# Altium schematic sheet ETH_PCIE_CTRL.SchDoc: =project_title
size Tabloid; CompanyName: Luxonis Holding; Organization: Luxonis Holding; Address1: 1925 Harmony Park Drive; Address2: Westminster, CO; Address3: 80234; Address4: United States; SheetNumber: 8; SheetTotal: 13
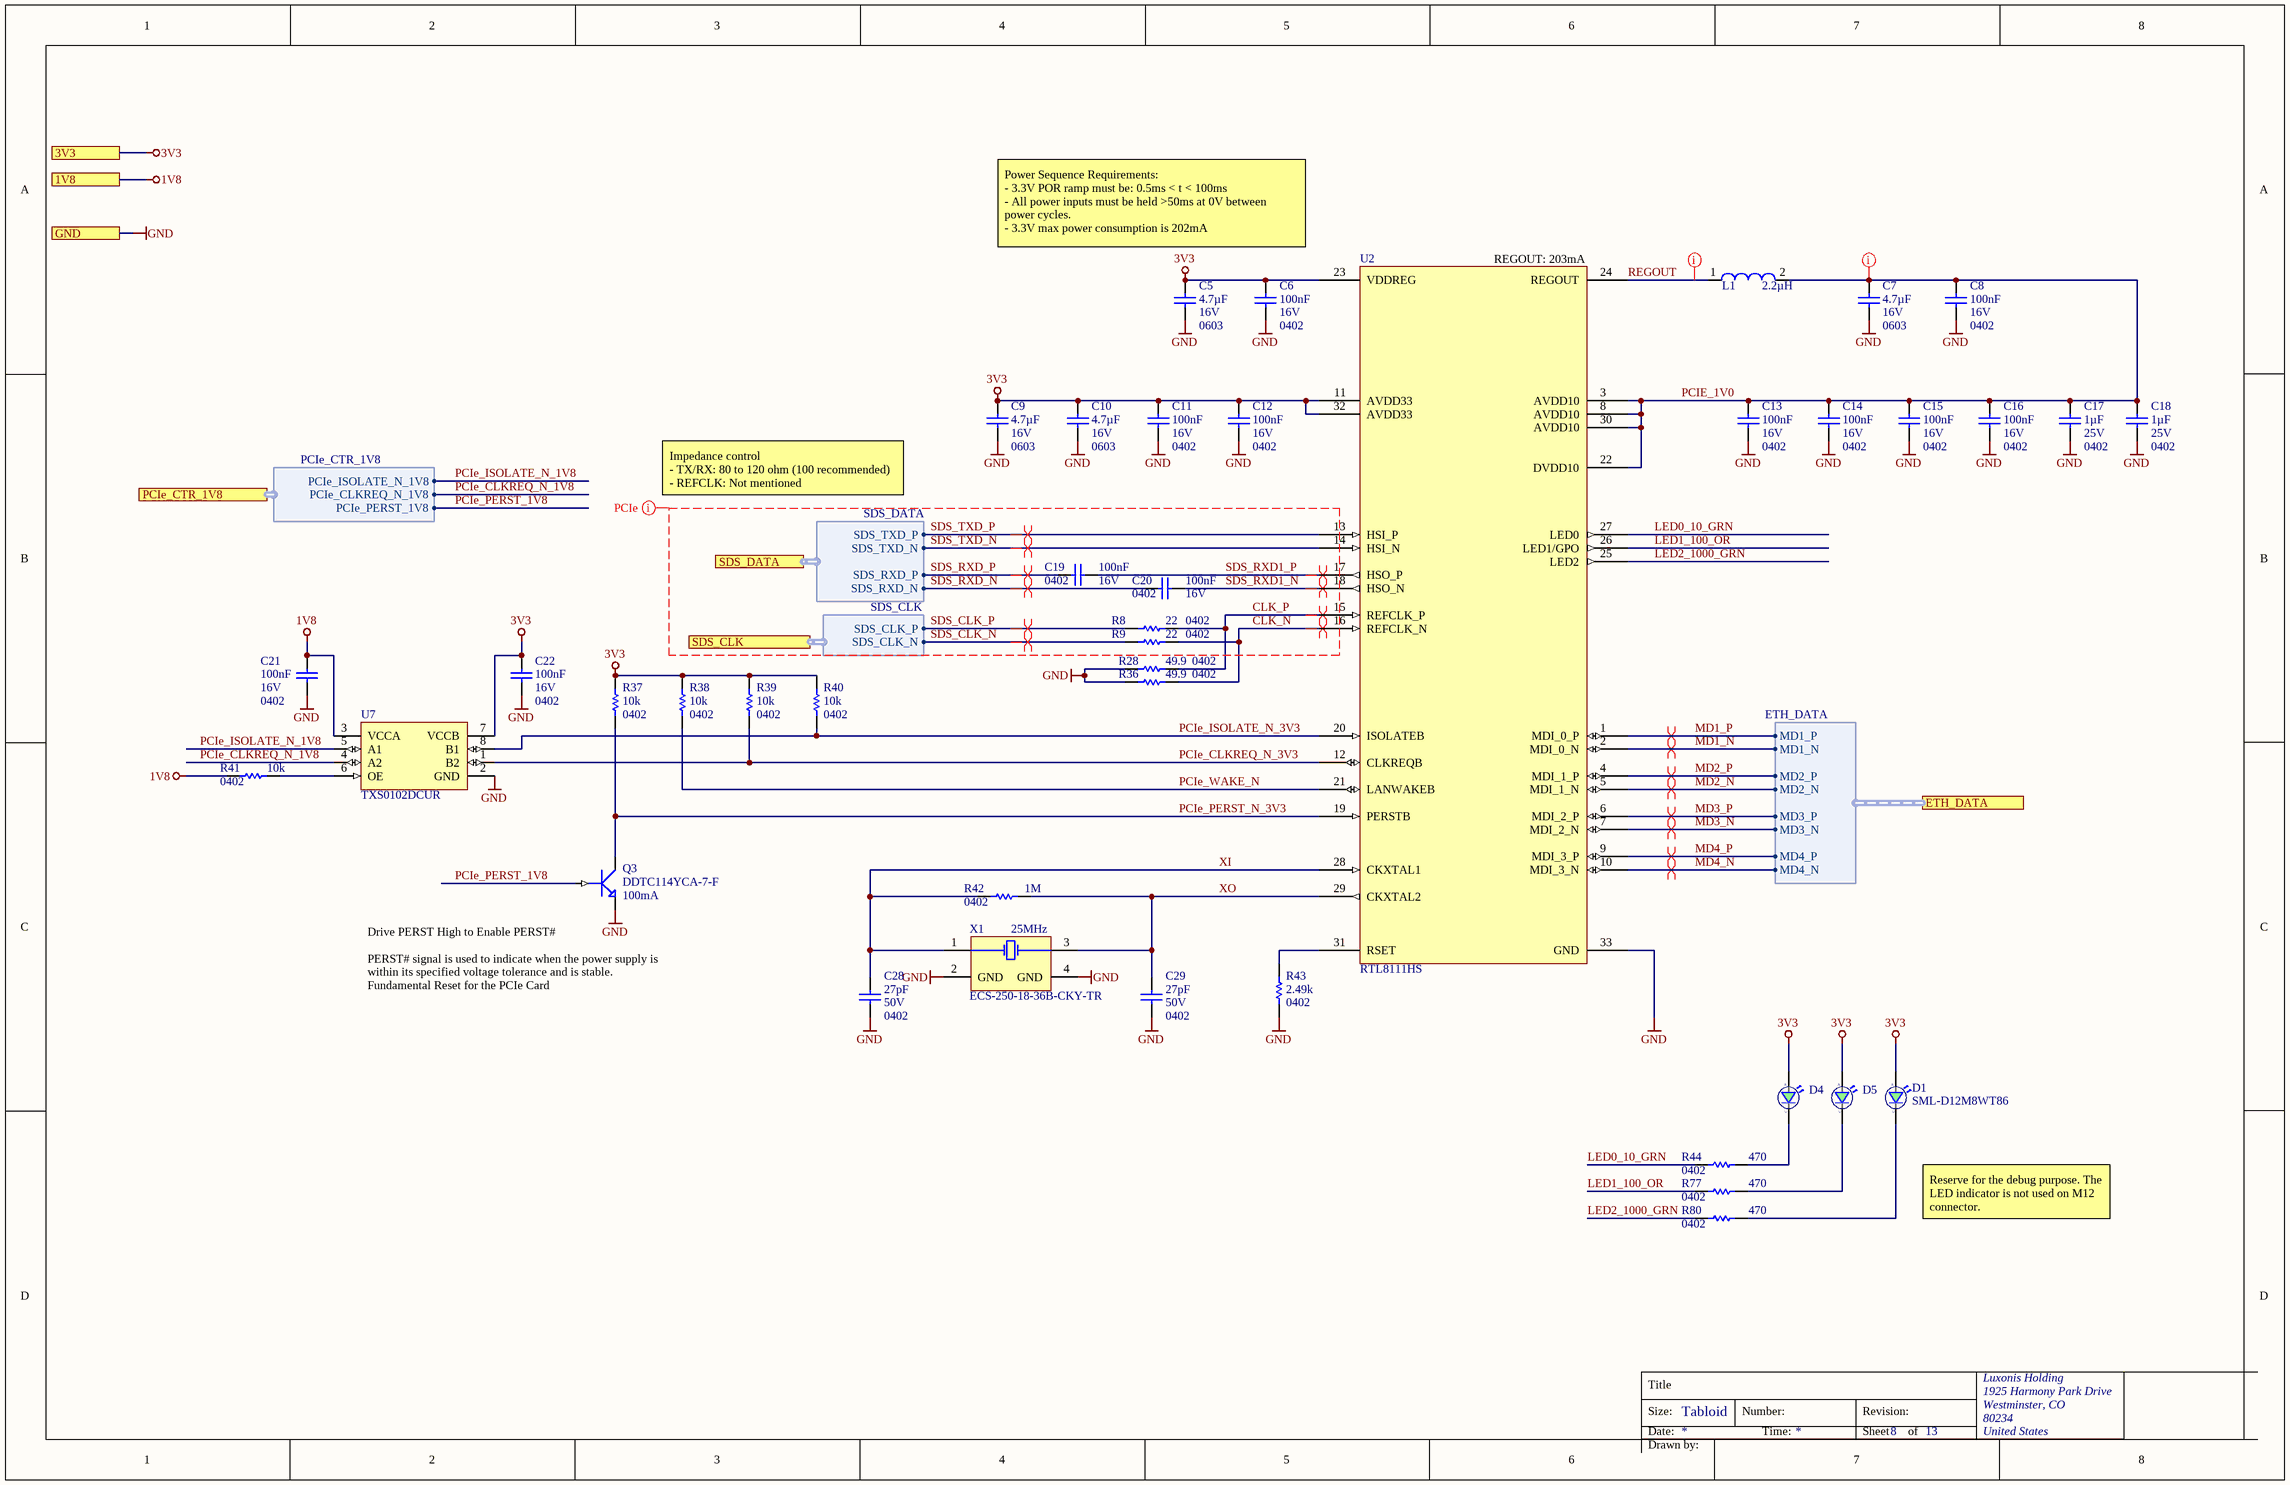
[diagram p0: ETH_PCIE_CTRL.SchDoc]

## Parts
C5  value 4.7µF  Voltage Rating: 16V  Case/Package: 0603  [CAPC0603(1608)100_L]  (hidden comment: GRM188R61C475KAAJD)
C6  value 100nF  Voltage Rating: 16V  Case/Package: 0402  [CAPC0402(1005)60_L]  (hidden comment: CL05B104KO5NFNC)
C7  value 4.7µF  Voltage Rating: 16V  Case/Package: 0603  [CAPC0603(1608)100_L]  (hidden comment: GRM188R61C475KAAJD)
C8  value 100nF  Voltage Rating: 16V  Case/Package: 0402  [CAPC0402(1005)60_L]  (hidden comment: CL05B104KO5NFNC)
C9  value 4.7µF  Voltage Rating: 16V  Case/Package: 0603  [CAPC0603(1608)100_L]  (hidden comment: GRM188R61C475KAAJD)
C10  value 4.7µF  Voltage Rating: 16V  Case/Package: 0603  [CAPC0603(1608)100_L]  (hidden comment: GRM188R61C475KAAJD)
C11  value 100nF  Voltage Rating: 16V  Case/Package: 0402  [CAPC0402(1005)60_L]  (hidden comment: CL05B104KO5NFNC)
C12  value 100nF  Voltage Rating: 16V  Case/Package: 0402  [CAPC0402(1005)60_L]  (hidden comment: CL05B104KO5NFNC)
C13  value 100nF  Voltage Rating: 16V  Case/Package: 0402  [CAPC0402(1005)60_L]  (hidden comment: CL05B104KO5NFNC)
C14  value 100nF  Voltage Rating: 16V  Case/Package: 0402  [CAPC0402(1005)60_L]  (hidden comment: CL05B104KO5NFNC)
C15  value 100nF  Voltage Rating: 16V  Case/Package: 0402  [CAPC0402(1005)60_L]  (hidden comment: CL05B104KO5NFNC)
C16  value 100nF  Voltage Rating: 16V  Case/Package: 0402  [CAPC0402(1005)60_L]  (hidden comment: CL05B104KO5NFNC)
C17  value 1µF  Voltage Rating: 25V  Case/Package: 0402  [CAPC0402(1005)70_L]  (hidden comment: GRM155R61E105KA12D)
C18  value 1µF  Voltage Rating: 25V  Case/Package: 0402  [CAPC0402(1005)70_L]  (hidden comment: GRM155R61E105KA12D)
C19  value 100nF  Voltage Rating: 16V  Case/Package: 0402  [CAPC0402(1005)60_L]  (hidden comment: CL05B104KO5NFNC)
C20  value 100nF  Voltage Rating: 16V  Case/Package: 0402  [CAPC0402(1005)60_L]  (hidden comment: CL05B104KO5NFNC)
C21  value 100nF  Voltage Rating: 16V  Case/Package: 0402  [CAPC0402(1005)60_L]  (hidden comment: CL05B104KO5NFNC)
C22  value 100nF  Voltage Rating: 16V  Case/Package: 0402  [CAPC0402(1005)60_L]  (hidden comment: CL05B104KO5NFNC)
C28  value 27pF  Voltage Rating: 50V  Case/Package: 0402  [CAPC0402(1005)60_L]  (hidden comment: C0402C270J5GACTU)
C29  value 27pF  Voltage Rating: 50V  Case/Package: 0402  [CAPC0402(1005)60_L]  (hidden comment: C0402C270J5GACTU)
D1  SML-D12M8WT86  [SML_D1xx8W]
D4  SML-D12M8WT86  [SML_D1xx8W]  (value not drawn)
D5  SML-D12M8WT86  [SML_D1xx8W]  (value not drawn)
L1  value 2.2µH  [LQH32NH2R2J23L]  (hidden comment: BRL3225T2R2M)
Q3  DDTC114YCA-7-F  Continuous Drain Current: 100mA  [DDTC114YCA-7-F-Footprint-1]
R8  value 22  Case/Package: 0402  [RESC0402(1005)_L]  (hidden comment: RC0402FR-0722RL)
R9  value 22  Case/Package: 0402  [RESC0402(1005)_L]  (hidden comment: RC0402FR-0722RL)
R28  value 49.9  Case/Package: 0402  [RESC0402(1005)_L]  (hidden comment: RC0402FR-0749R9L)
R36  value 49.9  Case/Package: 0402  [RESC0402(1005)_L]  (hidden comment: RC0402FR-0749R9L)
R37  value 10k  Case/Package: 0402  [RESC0402(1005)_L]  (hidden comment: RC0402FR-1310KL)
R38  value 10k  Case/Package: 0402  [RESC0402(1005)_L]  (hidden comment: RC0402FR-1310KL)
R39  value 10k  Case/Package: 0402  [RESC0402(1005)_L]  (hidden comment: RC0402FR-1310KL)
R40  value 10k  Case/Package: 0402  [RESC0402(1005)_L]  (hidden comment: RC0402FR-1310KL)
R41  value 10k  Case/Package: 0402  [RESC0402(1005)_L]  (hidden comment: RC0402FR-1310KL)
R42  value 1M  Case/Package: 0402  [RESC0402(1005)_L]  (hidden comment: RC0402FR-071ML)
R43  value 2.49k  Case/Package: 0402  [RESC0402(1005)_L]  (hidden comment: RC0402FR-072K49L)
R44  value 470  Case/Package: 0402  [RESC0402(1005)_L]  (hidden comment: CRCW0402470RFKED)
R77  value 470  Case/Package: 0402  [RESC0402(1005)_L]  (hidden comment: CRCW0402470RFKED)
R80  value 470  Case/Package: 0402  [RESC0402(1005)_L]  (hidden comment: CRCW0402470RFKED)
U2  RTL8111HS  [RTL8111Hx-CG]
U7  TXS0102DCUR  [TXS0102DCUR]
X1  ECS-250-18-36B-CKY-TR  Frequency: 25MHz  [ECS-250-18-36B-CKY-TR]

## Ports
1V8, 3V3, ETH_DATA (harness ETH_DATA), GND, PCIe_CTR_1V8 (harness PCIe_CTR_1V8), SDS_CLK (harness SDS_CLK), SDS_DATA (harness SDS_DATA)

## Harnesses
ETH_DATA: MD1_P, MD1_N, MD2_P, MD2_N, MD3_P, MD3_N, MD4_P, MD4_N
SDS_DATA: SDS_TXD_P, SDS_TXD_N, SDS_RXD_P, SDS_RXD_N
SDS_CLK: SDS_CLK_P, SDS_CLK_N
PCIe_CTR_1V8: PCIe_CLKREQ_N_1V8, PCIe_ISOLATE_N_1V8, PCIe_PERST_1V8

## Nets
1V8: C21.2 R41.1 U7.3(VCCA) ; port 1V8
3V3: C5.2 C6.2 C9.2 C10.2 C11.2 C12.2 C22.2 D1.2(A) D4.2(A) D5.2(A) R37.2 R38.2 R39.2 R40.2 U2.11(AVDD33) U2.23(VDDREG) U2.32(AVDD33) U7.7(VCCB) ; port 3V3
GND: C5.1 C6.1 C7.1 C8.1 C9.1 C10.1 C11.1 C12.1 C13.1 C14.1 C15.1 C16.1 C17.1 C18.1 C21.1 C22.1 C28.1 C29.1 Q3.2(E) R28.1 R36.1 R43.1 U2.33(GND) U7.2(GND) X1.2(GND) X1.4(GND) ; port GND
CLK_N: R9.2 R36.2 U2.16(REFCLK_N)
CLK_P: R8.2 R28.2 U2.15(REFCLK_P)
LED0_10_GRN: R44.1 U2.27(LED0)
LED1_100_OR: R77.1 U2.26(LED1/GPO)
LED2_1000_GRN: R80.1 U2.25(LED2)
MD1_N: U2.2(MDI_0_N) ; port ETH_DATA.MD1_N
MD1_P: U2.1(MDI_0_P) ; port ETH_DATA.MD1_P
MD2_N: U2.5(MDI_1_N) ; port ETH_DATA.MD2_N
MD2_P: U2.4(MDI_1_P) ; port ETH_DATA.MD2_P
MD3_N: U2.7(MDI_2_N) ; port ETH_DATA.MD3_N
MD3_P: U2.6(MDI_2_P) ; port ETH_DATA.MD3_P
MD4_N: U2.10(MDI_3_N) ; port ETH_DATA.MD4_N
MD4_P: U2.9(MDI_3_P) ; port ETH_DATA.MD4_P
PCIE_1V0: C7.2 C8.2 C13.2 C14.2 C15.2 C16.2 C17.2 C18.2 L1.2 U2.3(AVDD10) U2.8(AVDD10) U2.22(DVDD10) U2.30(AVDD10)
PCIe_CLKREQ_N_1V8: U7.4(A2) ; port PCIe_CTR_1V8.PCIe_CLKREQ_N_1V8
PCIe_CLKREQ_N_3V3: R39.1 U2.12(CLKREQB) U7.1(B2)
PCIe_ISOLATE_N_1V8: U7.5(A1) ; port PCIe_CTR_1V8.PCIe_ISOLATE_N_1V8
PCIe_ISOLATE_N_3V3: R40.1 U2.20(ISOLATEB) U7.8(B1)
PCIe_PERST_1V8: Q3.1(B) ; port PCIe_CTR_1V8.PCIe_PERST_1V8
PCIe_PERST_N_3V3: Q3.3(C) R37.1 U2.19(PERSTB)
PCIe_WAKE_N: R38.1 U2.21(LANWAKEB)
REGOUT: L1.1 U2.24(REGOUT)
SDS_CLK_N: R9.1 ; port SDS_CLK.SDS_CLK_N
SDS_CLK_P: R8.1 ; port SDS_CLK.SDS_CLK_P
SDS_RXD1_N: C20.1 U2.18(HSO_N)
SDS_RXD1_P: C19.1 U2.17(HSO_P)
SDS_RXD_N: C20.2 ; port SDS_DATA.SDS_RXD_N
SDS_RXD_P: C19.2 ; port SDS_DATA.SDS_RXD_P
SDS_TXD_N: U2.14(HSI_N) ; port SDS_DATA.SDS_TXD_N
SDS_TXD_P: U2.13(HSI_P) ; port SDS_DATA.SDS_TXD_P
XI: C28.2 R42.1 U2.28(CKXTAL1) X1.1(X1)
XO: C29.2 R42.2 U2.29(CKXTAL2) X1.3(X2)
NetD1_1: D1.1(C) R80.2
NetD4_1: D4.1(C) R44.2
NetD5_1: D5.1(C) R77.2
NetR41_2: R41.2 U7.6(OE)
NetR43_2: R43.2 U2.31(RSET)

## Layout directives
differential pair; net class ETH; differential pair class 100ohm: MD1_N, MD1_P, MD2_N, MD2_P, MD3_N, MD3_P, MD4_N, MD4_P
net class PCIe: CLK_N, CLK_P, SDS_CLK_N, SDS_CLK_P, SDS_RXD1_N, SDS_RXD1_P, SDS_RXD_N, SDS_RXD_P, SDS_TXD_N, SDS_TXD_P
differential pair; net class PCIE; differential pair class 100ohm: CLK_N, CLK_P, SDS_CLK_N, SDS_CLK_P, SDS_RXD1_N, SDS_RXD1_P, SDS_RXD_N, SDS_RXD_P, SDS_TXD_N, SDS_TXD_P
net class PWR; Current Rating: 1200mA: PCIE_1V0, REGOUT

## Notes on the sheet
- Power Sequence Requirements:
  - 3.3V POR ramp must be: 0.5ms < t < 100ms
  - All power inputs must be held >50ms at 0V between power cycles.
  - 3.3V max power consumption is 202mA
- (near U2) REGOUT: 203mA
- Impedance control
  - TX/RX: 80 to 120 ohm (100 recommended)
  - REFCLK: Not mentioned
  - Confirmed that 100ohm on TX/RX/REFCLK of NG2099
- (near Q3) Drive PERST High to Enable PERST#
- PERST# signal is used to indicate when the power supply is within its specified voltage tolerance and is stable.
  Fundamental Reset for the PCIe Card
- Reserve for the debug purpose. The LED indicator is not used on M12 connector.
- Title
- Size:
- Date:
- Tabloid
- Number:
- Time:
- Revision:
- Sheet
- of
- Drawn by:

## Library data of the parts
C5 C7 C9 C10 = CMP-004-000020-4: CAP CER 4.7UF 16V X5R 0603 10%; Manufacturer 1: Murata; Max Operating Temperature: 85°C; Dielectric: X5R; Design Item ID: GRM188R61C475KAAJD; Depth: 0.8mm; Width: 0.8mm; Manufacturer 2: Murata; Manufacturer Part Number 3: GRM188R61C475KAAJD; Manufacturer Part Number 2: GRM188R61C475KAAJD; ComponentLink1Description: https://datasheet.ciiva.com/14813/595grm188r61c475kaaj23-14813668.pdf?src-supplier=Arrow; ComponentLink1URL: https://datasheet.ciiva.com/14813/595grm188r61c475kaaj23-14813668.pdf?src-supplier=Arrow; Manufacturer Part Number 1: GRM188R61C475KAAJD; Manufacturer 3: Murata; Mounting Technology: SMT; Tolerance: 10%; Length: 1.6mm; Min Operating Temperature: -55°C; Height: 0.8mm
C6 C8 C11-C16 C19-C22 = CMP-108-000002-6: CAP CER 0.1UF 16V X7R 0402 10%; Manufacturer 1: Samsung; ComponentLink1URL: https://datasheet.ciiva.com/25767/cl05b104ko5nfnc-25767124.pdf?src-supplier=Digi-Key; Length: 1mm; Design Item ID: CL05B104KO5NFNC; Tolerance: 10%; Min Operating Temperature: -55°C; Width: 0.02inch; Dielectric: X7R; ComponentLink1Description: https://datasheet.ciiva.com/25767/cl05b104ko5nfnc-25767124.pdf?src-supplier=Digi-Key; Height: 0.5mm; Depth: 0.5mm; Manufacturer Part Number 1: CL05B104KO5NFNC; Max Operating Temperature: 125°C; Mounting Technology: SMT
C17 C18 = CMP-108-000014-5: CAP CER 1UF 25V X5R 0402 10%; Manufacturer 1: Murata; ComponentLink2Description: https://datasheet.ciiva.com/7719/1666664-7719006.pdf?src-supplier=Element14; ComponentLink2URL: https://datasheet.ciiva.com/7719/1666664-7719006.pdf?src-supplier=Element14; Max Operating Temperature: 85°C; Depth: 0.5mm; Mounting Technology: SMT; ComponentLink1URL: https://datasheet.ciiva.com/22732/1666664-22732122.pdf?src-supplier=Element14; Length: 1mm; ComponentLink1Description: https://datasheet.ciiva.com/22732/1666664-22732122.pdf?src-supplier=Element14; Manufacturer Part Number 1: GRM155R61E105KA12D; Tolerance: 10%; Design Item ID: GRM155R61E105KA12D; Dielectric: X5R; Min Operating Temperature: -55°C; Height: 0.5mm; Width: 0.5mm
C28 C29 = CMP-108-000006-6: CAP CER 27PF 50V C0G 0402 5%; Manufacturer 1: KEMET; Min Operating Temperature: -55°C; Mounting Technology: SMT; Design Item ID: C0402C270J5GACTU; Tolerance: 5%; Max Operating Temperature: 125°C; ComponentLink4Description: https://datasheet.ciiva.com/7392/1372242-7392237.pdf?src-supplier=Newark; Width: 0.5mm; Length: 1mm; ComponentLink1URL: https://datasheet.ciiva.com/144/docfinderpartnumber-c0402c270j5gactu-144118.pdf?src-supplier=Digi-Key; ComponentLink2URL: https://datasheet.ciiva.com/7747/kem-c1003-c0g-smd-7747509.pdf?src-supplier=Element14; ComponentLink4URL: https://datasheet.ciiva.com/7392/1372242-7392237.pdf?src-supplier=Newark; ComponentLink5Description: https://datasheet.ciiva.com/14586/70095383-14586671.pdf?src-supplier=Allied+Electronics; Height: 0.5mm; ComponentLink3Description: https://datasheet.ciiva.com/26847/getdatasheetpartid-408632-26847386.pdf?src-supplier=Verical; Dielectric: C0G; ComponentLink5URL: https://datasheet.ciiva.com/14586/70095383-14586671.pdf?src-supplier=Allied+Electronics; Manufacturer Part Number 1: C0402C270J5GACTU; ComponentLink2Description: https://datasheet.ciiva.com/7747/kem-c1003-c0g-smd-7747509.pdf?src-supplier=Element14; ComponentLink3URL: https://datasheet.ciiva.com/26847/getdatasheetpartid-408632-26847386.pdf?src-supplier=Verical; ComponentLink1Description: https://datasheet.ciiva.com/144/docfinderpartnumber-c0402c270j5gactu-144118.pdf?src-supplier=Digi-Key; Depth: 0.5mm
D1 D4 D5 = CMP-111-000004-2: LED GREEN DIFFUSED 0603 SMD Green 572nm LED Indication - Discrete 2.2V 0603 (1608 Metric); Manufacturer 1: Rohm; Forward Current: 20mA; Color: Green,Yellow; Min Operating Temperature: -40°C; Forward Voltage: 2.2V; Max Operating Temperature: 85°C; Case/Package: 0603; Manufacturer Part Number 1: SML-D12M8WT86
L1 = CMP-006-00079-1: Inductor Power Chip Wirewound 2.2uH 20% 100KHz Ferrite 1.6A 0.078Ohm DCR 1210 T/R; Manufacturer 1: Taiyo Yuden; Saturation Current: 1.85A; Self Resonant Frequency: 150MHz; Tolerance: 20%; Case/Package: Nonstandard; Manufacturer Part Number 1: BRL3225T2R2M; Current Rating: 1.6A
Q3 = CMP-074-000000-4: TRANS PREBIAS NPN 200MW SOT23-3; Manufacturer 1: Diodes; Max Drain to Source Voltage: 50V; Manufacturer Part Number 1: DDTC114YCA-7-F; Case/Package: SOT-23-3; Design Item ID: DDTC114YCA-7-F
R8 R9 = CMP-013-000012-8: RES SMD 22 OHM 1% 1/16W 0402; Manufacturer 1: Yageo; Power Rating: 62.5mW; Min Operating Temperature: -55°C; Tolerance: 1%; Design Item ID: RC0402FR-0722RL; Manufacturer Part Number 1: RC0402FR-0722RL; Max Operating Temperature: 155°C
R28 R36 = CMP-115-000016-6: RES SMD 49.9 OHM 1% 1/16W 0402; Manufacturer 1: Yageo; Temperature Coefficient: 100ppm/°C; Voltage Rating: 50V; Power Rating: 62.5mW; Design Item ID: RC0402FR-0749R9L; Min Operating Temperature: -55°C; Max Operating Temperature: 155°C; Tolerance: 1%; Manufacturer Part Number 1: RC0402FR-0749R9L
R37-R41 = CMP-115-000004-8: RES SMD 10K OHM 1% 1/16W 0402; Manufacturer 1: Yageo; Power Rating: 62.5mW; Temperature Coefficient: 100ppm/°C; Voltage Rating: 50V; Min Operating Temperature: -55°C; Max Operating Temperature: 155°C; Design Item ID: RC0402FR-1310KL; Tolerance: 1%; Manufacturer Part Number 1: RC0402FR-1310KL
R42 = CMP-013-000005-8: RES SMD 1M OHM 1% 1/16W 0402; Manufacturer 1: Yageo; Power Rating: 63mW; Voltage Rating: 50V; Tolerance: 1%; Min Operating Temperature: -55°C; Manufacturer Part Number 1: RC0402FR-071ML; Design Item ID: RC0402FR-071ML; Max Operating Temperature: 155°C
R43 = CMP-115-000015-6: RES SMD 2.49K OHM 1% 1/16W 0402; Manufacturer 1: Yageo; Temperature Coefficient: 100ppm/°C; Power Rating: 62.5mW; Voltage Rating: 50V; Max Operating Temperature: 155°C; Min Operating Temperature: -55°C; Manufacturer Part Number 1: RC0402FR-072K49L; Tolerance: 1%; Design Item ID: RC0402FR-072K49L
R44 R77 R80 = CMP-013-000029-9: RES SMD 470 OHM 1% 1/16W 0402; Manufacturer 1: Vishay; Voltage Rating: 50V; Power Rating: 63mW; Max Operating Temperature: 155°C; Min Operating Temperature: -55°C; Tolerance: 1%; Design Item ID: CRCW0402470RFKED; Manufacturer Part Number 1: CRCW0402470RFKED
U2 = CMP-113-000000-3: IC ETHERNET/PCIe PHY Realtek; Manufacturer Part Number 1: RTL8111HS-CG; Manufacturer 1: Realtek
U7 = CMP-113-000005-2: TEXAS INSTRUMENTS - TXS0102DCUR - IC, TRANSLATOR, 2 BIT, BI, US-8; Max Supply Voltage: 5.5V; Max Output Current: 1A; Min Supply Voltage: 1.65V; Max Operating Temperature: 85°C; Pins: 8; Manufacturer 1: Texas Instruments; Manufacturer Part Number 1: TXS0102DCUR; Case/Package: VSSOP; Min Operating Temperature: -40°C
X1 = CMP-006-000002-2: CRYSTAL 25.0000MHZ 18PF SMD 25MHz ±10ppm Crystal 18pF 50 Ohms 4-SMD, No Lead; Manufacturer 1: ECS International; Manufacturer Part Number 1: ECS-250-18-36B-CKY-TR